# Altium schematic sheet CAN.SchDoc
size A; SheetNumber: 9; SheetTotal: 16
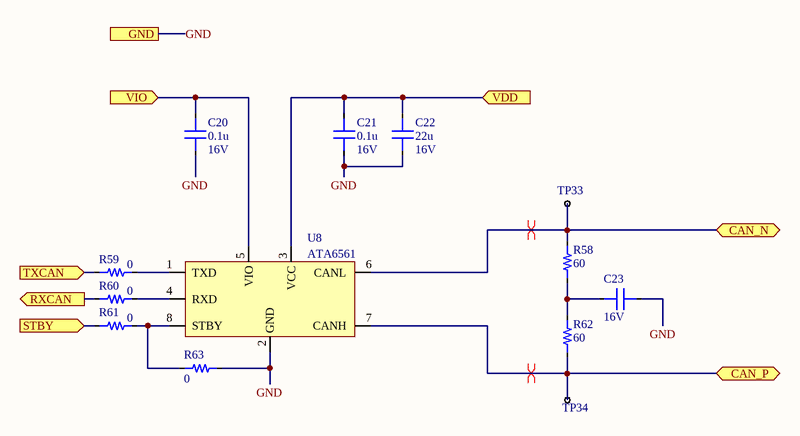
[diagram p0: CAN.SchDoc]

## Parts
C20  value 0.1u  Voltage: 16V  [0603_CAP]  (hidden comment: Capacitor)
C21  value 0.1u  Voltage: 16V  [0603_CAP]  (hidden comment: Capacitor)
C22  value 22u  Voltage: 16V  [0805_CAP]  (hidden comment: Capacitor)
C23  Voltage: 16V  [0603_CAP]  (hidden comment: Capacitor)
R58  value 60  [0603_RES]  (hidden comment: Resistor)
R59  value 0  [0603_RES]  (hidden comment: Resistor)
R60  value 0  [0603_RES]  (hidden comment: Resistor)
R61  value 0  [0603_RES]  (hidden comment: Resistor)
R62  value 60  [0603_RES]  (hidden comment: Resistor)
R63  value 0  [0603_RES]  (hidden comment: Resistor)
TP33  1mm Testpoint  [1mm_testpoint]  (value not drawn)
TP34  1mm Testpoint  [1mm_testpoint]  (value not drawn)
U8  ATA6561  [SOIC-8]

## Ports
CAN_N (bidir), CAN_P (bidir), GND, RXCAN (out), STBY (in), TXCAN (in), VDD (in), VIO (in)

## Nets
CAN_N: R58.2 TP33.1 U8.6(CANL) ; port CAN_N
CAN_P: R62.1 TP34.1 U8.7(CANH) ; port CAN_P
GND: C20.1 C21.1 C22.1 C23.2 R63.2 U8.2(GND) ; port GND
RXCAN: R60.1 ; port RXCAN
STBY: R61.1 ; port STBY
TXCAN: R59.1 ; port TXCAN
VDD: C21.2 C22.2 U8.3(VCC) ; port VDD
VIO: C20.2 U8.5(VIO) ; port VIO
NetC23_1: C23.1 R58.1 R62.2
NetR59_2: R59.2 U8.1(TXD)
NetR60_2: R60.2 U8.4(RXD)
NetR61_2: R61.2 R63.1 U8.8(STBY)

## Layout directives
differential pair: CAN_N, CAN_P

## Library data of the parts
TP33 TP34 = 1mm Testpoint: 1mm test point; ComponentLink1Description: Digikey; ComponentLink1URL: https://www.digikey.com/product-detail/en/te-connectivity-amp-connectors/RCU-0C/A106145CT-ND/3477802
U8 = ATA6561: 1/1 Transceiver CANbus 8-SO; Vcc: 5; Name: ATA6561; Type: CAN; ComponentLink1Description: Digikey; ComponentLink1URL: https://www.digikey.com/en/products/detail/microchip-technology/ATA6561-GAQW-N/9453105; ComponentLink2Description: Datasheet; ComponentLink2URL: https://ww1.microchip.com/downloads/en/DeviceDoc/20005991B.pdf
C20-C23 = Capacitor: Dielectric: *; Percent Tolerance: *; ESR: *
R58-R63 = Resistor: Tolerance: *